# EAGLE design STM32F050_BreakoutBoard (EAGLE 6.4)
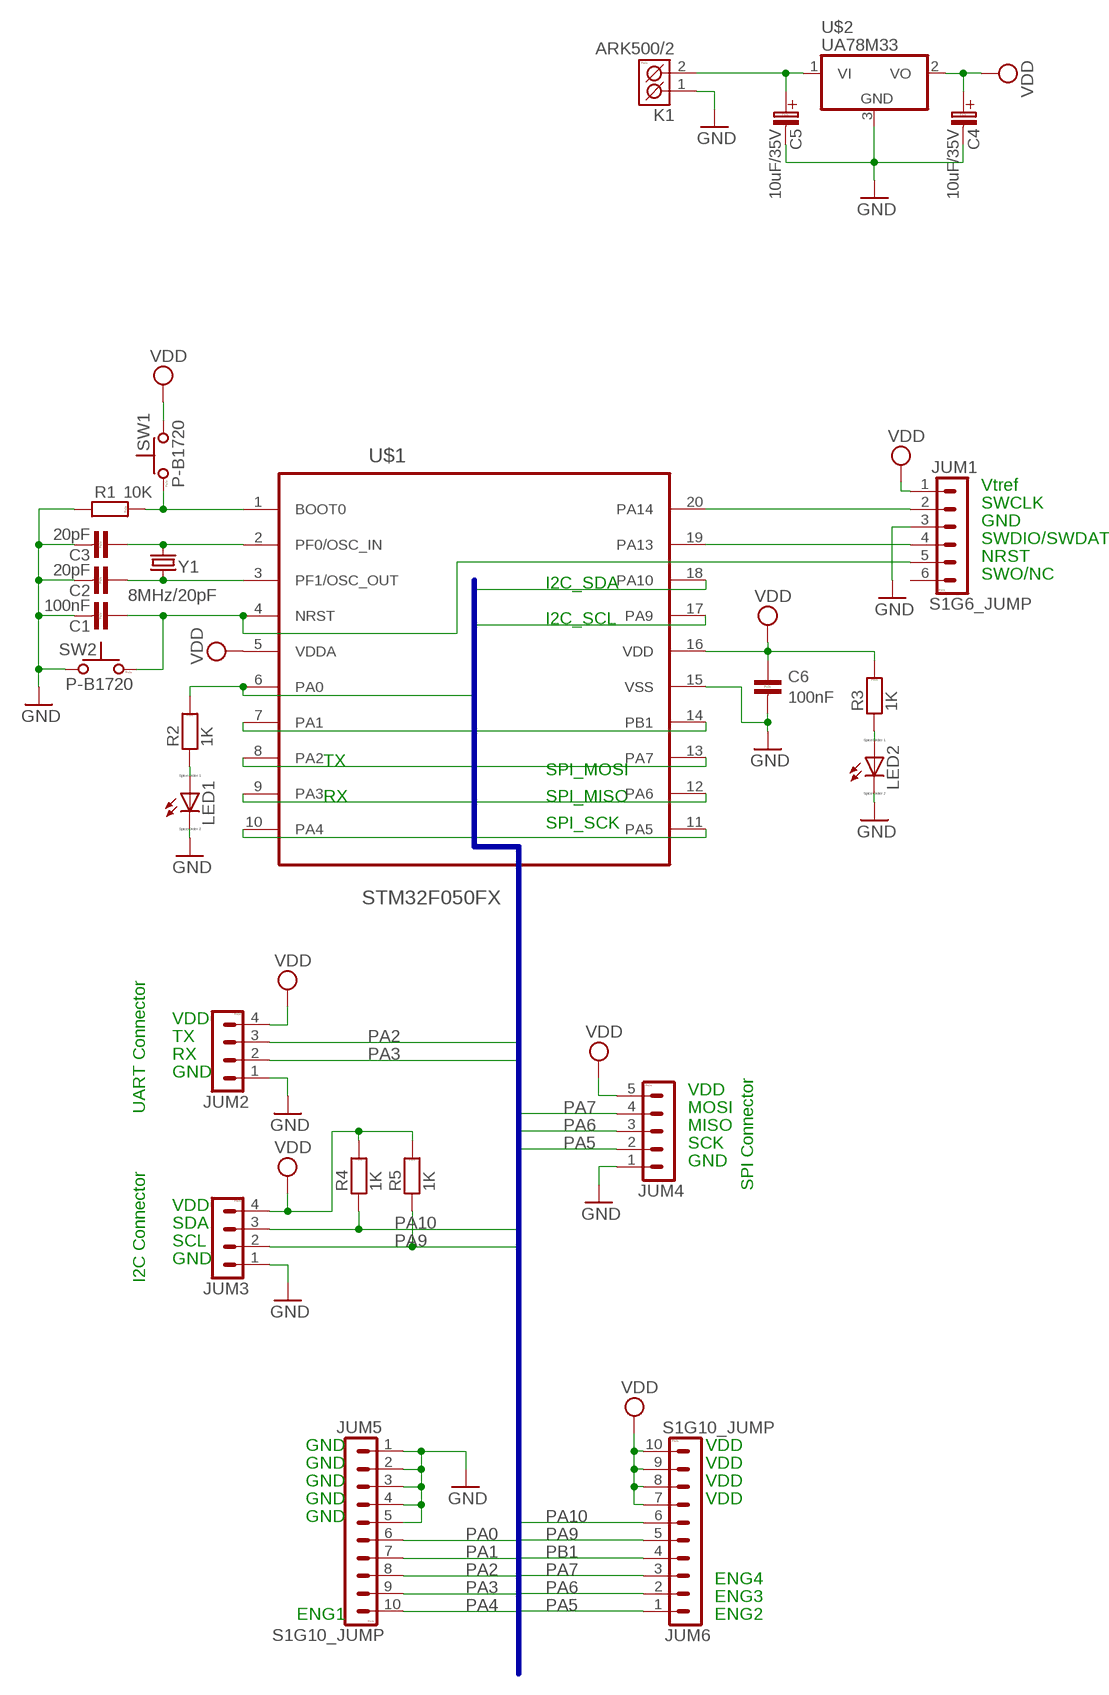
[diagram p0: schematic, sheet 1]

## Parts
C1  100nF  C-KERAMIK_SMD_1206  [1206]
C2  20pF  C-KERAMIK_SMD_1206  [1206]
C3  20pF  C-KERAMIK_SMD_1206  [1206]
C4  10uF/35V  C-ELEKTROLYT_2,5  [C-EL_2,5]
C5  10uF/35V  C-ELEKTROLYT_2,5  [C-EL_2,5]
C6  100nF  C-KERAMIK_SMD_1206  [1206]
JUM1  S1G6_JUMP  [S1G6_JUM]
JUM2  S1G4_JUMP  [S1G4_JUM]
JUM3  S1G4_JUMP  [S1G4_JUM]
JUM4  S1G5_JUMP  [S1G5_JUM]
JUM5  S1G10_JUMP  [S1G10_JU]
JUM6  S1G10_JUMP  [S1G10_JU]
K1  ARK500/2  [ARK500/2]
LED1  LED_E  [LED_1206]
LED2  LED_E  [LED_1206]
R1  10K  R_SMD_1206  [1206]
R2  1K  R_SMD_1206  [1206]
R3  1K  R_SMD_1206  [1206]
R4  1K  R_SMD_1206  [1206]
R5  1K  R_SMD_1206  [1206]
SW1  P-B1720  [P-B1720]
SW2  P-B1720  [P-B1720]
U$1  STM32F050FX  [TSSOP20]
U$2  UA78M33  [TO252]
Y1  8MHz/20pF  CRYSTALSMD  [HC49UP]

## Nets
GND: C1.2 C2.2 C3.2 C4.C-(C_EL-) C5.C-(C_EL-) C6.2 JUM1.3 JUM2.1 JUM3.1 JUM4.1 JUM5.1 JUM5.2 JUM5.3 JUM5.4 JUM5.5 K1.1(K1) LED1.C LED2.C R1.1 SW2.2 U$1.15(VSS) U$2.3(GND)
N$1: C3.1 U$1.2(PF0/OSC_IN) Y1.2
N$2: C2.1 U$1.3(PF1/OSC_OUT) Y1.1
N$3: R1.2 SW1.1 U$1.1(BOOT0)
N$4: C5.C+(C_EL+) K1.2(K2) U$2.1(VI)
N$7: LED1.A R2.1
N$8: JUM1.2 U$1.20(PA14)
N$9: JUM1.4 U$1.19(PA13)
N$10: C1.1 JUM1.5 SW2.1 U$1.4(NRST)
N$11: LED2.A R3.1
PA0: JUM5.6 R2.2 U$1.6(PA0)
PA1: JUM5.7 U$1.7(PA1)
PA2: JUM2.3 JUM5.8 U$1.8(PA2)
PA3: JUM2.2 JUM5.9 U$1.9(PA3)
PA4: JUM5.10 U$1.10(PA4)
PA5: JUM4.2 JUM6.1 U$1.11(PA5)
PA6: JUM4.3 JUM6.2 U$1.12(PA6)
PA7: JUM4.4 JUM6.3 U$1.13(PA7)
PA9: JUM3.2 JUM6.5 R5.1 U$1.17(PA9)
PA10: JUM3.3 JUM6.6 R4.1 U$1.18(PA10)
PB1: JUM6.4 U$1.14(PB1)
VDD: C4.C+(C_EL+) C6.1 JUM1.1 JUM2.4 JUM3.4 JUM4.5 JUM6.7 JUM6.8 JUM6.9 JUM6.10 R3.2 R4.2 R5.2 SW1.2 U$1.5(VDDA) U$1.16(VDD) U$2.2(VO)
Unconnected: JUM1.6 SW1.3 SW1.4 SW2.3 SW2.4

## Buses
PA[0..7],PA9,PA10,PB1

## Notes on the sheet
- Vtref
- SWCLK
- GND
- SWDIO/SWDAT
- NRST
- SWO/NC
- I2C_SDA
- I2C_SCL
- TX
- SPI_MOSI
- RX | SPI_MISO
- SPI_SCK
- VDD
- TX
- RX
- GND | SPI Connector
- VDD
- UART Connector | MOSI
- MISO
- SCK
- GND
- VDD
- SDA
- SCL
- GND
- I2C Connector
- GND | VDD
- GND | VDD
- GND | VDD
- GND | VDD
- GND
- ENG4
- ENG3
- ENG1 | ENG2

## Library data of the parts
C1-C3 C6 = #PaJa_30:C-KERAMIK: Kondenzator - keramicky
C4 C5 = #PaJa_30:C-ELEKTROLYT: Kondenzator - elektrolyticky
JUM1 = #PaJa_konektory:S1G6_JUMP: Radove konektory - koliky - 6x
JUM2 JUM3 = #PaJa_konektory:S1G4_JUMP: Radove konektory - koliky - 4x
JUM4 = #PaJa_konektory:S1G5_JUMP: Radove konektory - koliky - 5x
JUM5 JUM6 = #PaJa_konektory:S1G10_JUMP: Radove konektory - koliky - 10x
K1 = #PaJa_konektory:ARK500/2: Svorkovnice - roztec 5mm - dvojita
LED1 LED2 = eagle-ltspice:LED_E: LED Source: http://www.osram.convergy.de Source: www.luxeon.com Source: www.kingbright.com; SPICEMODEL: NONE; SPICEPREFIX: D; SPICETYPE: diode
R1-R5 = #PaJa_30:R: Rezistor
SW1 SW2 = #PaJa_prepinace:P-B1720: µ-tlacitko
U$1 = !moje_Sobriety:STM32F050FX
U$2 = !moje_Sobriety:UA78M33
Y1 = SparkFun:CRYSTAL: Crystals Various standard crystals. Proven footprints. Spark Fun Electronics SKU : COM-00534

## Board
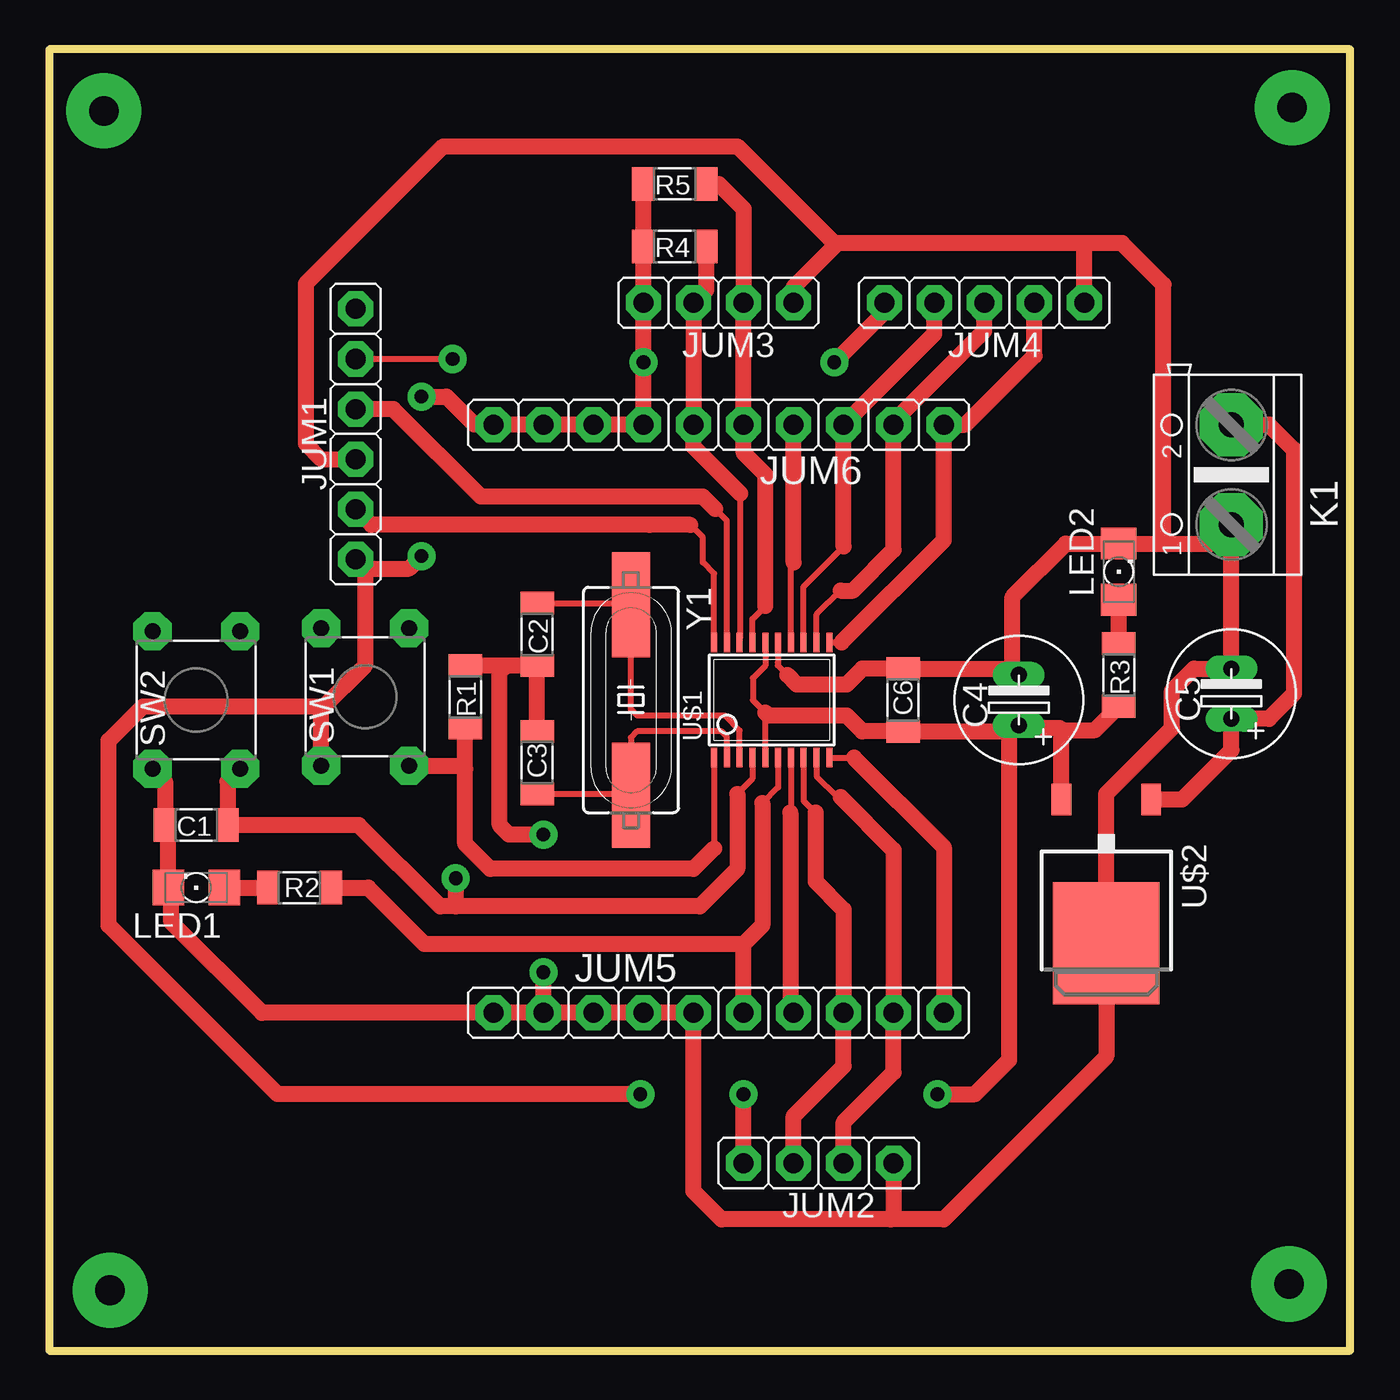
[diagram p1: board, top side]
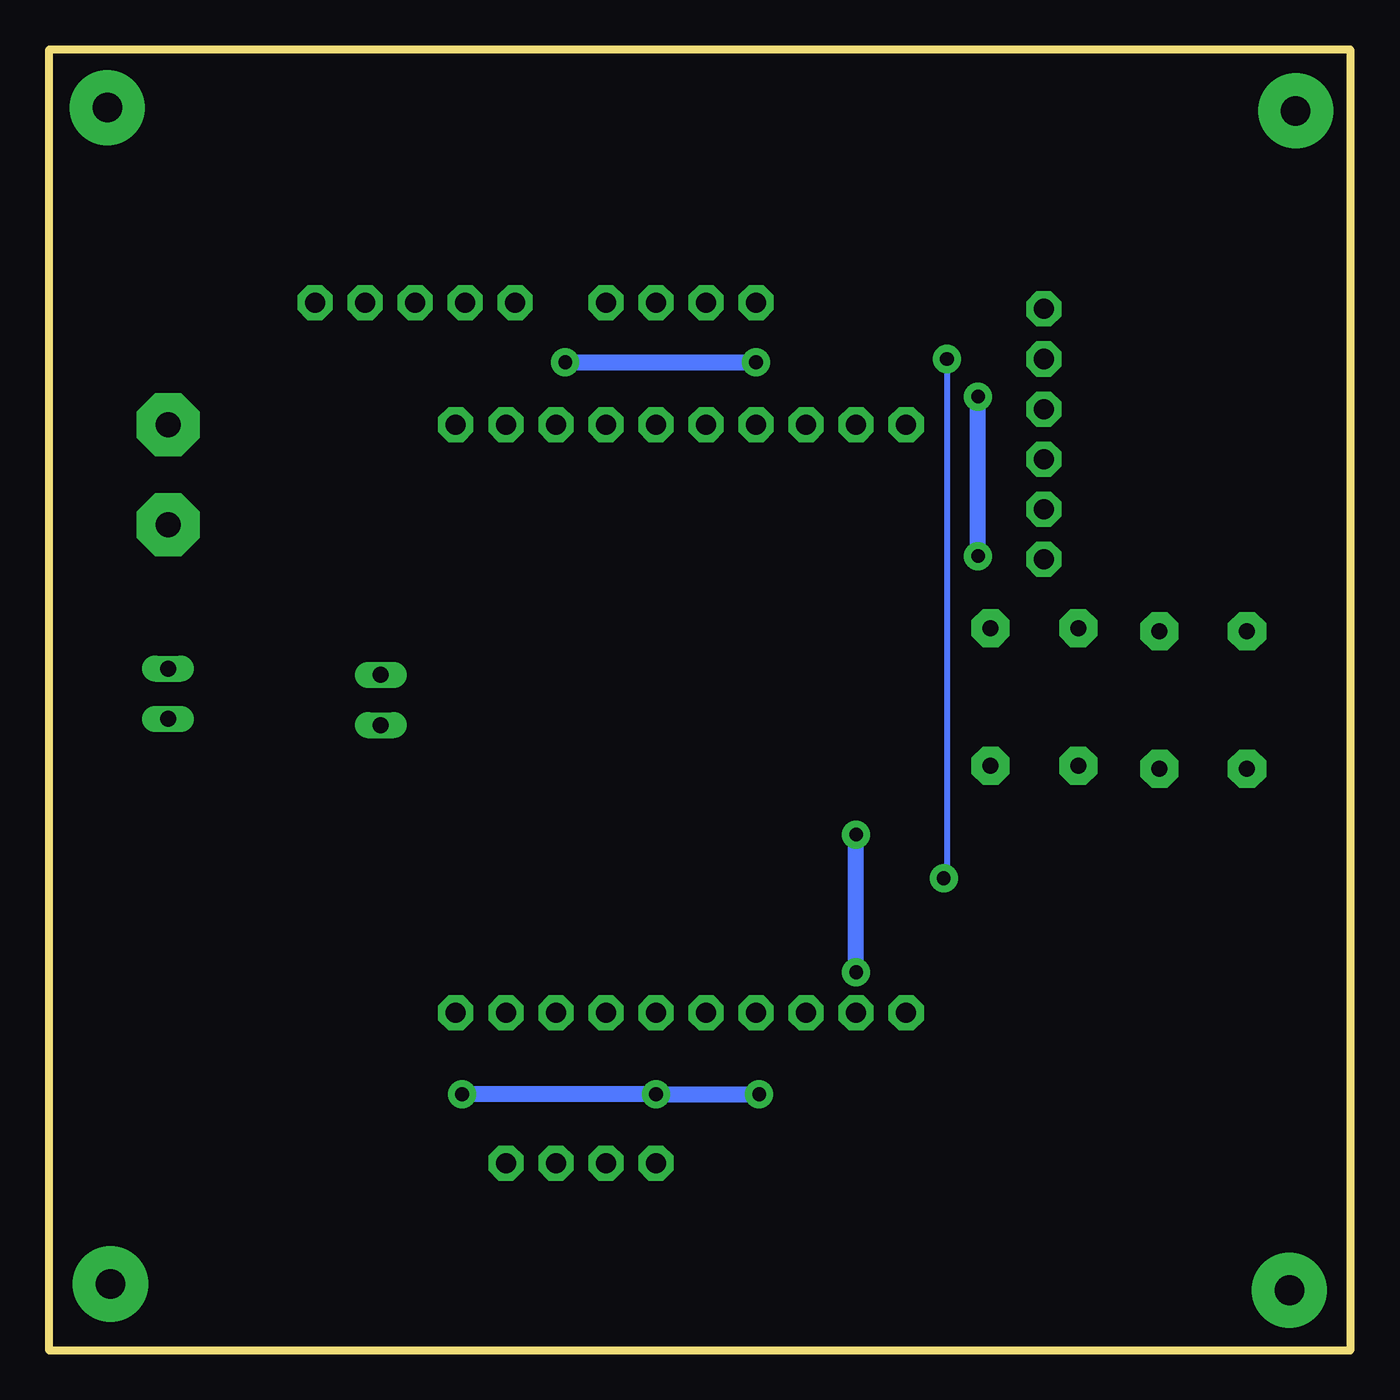
[diagram p2: board, bottom side, seen from below]

Size 66.04 x 66.04 mm. Coordinates in mm from the lower left corner, seen from the top.
Outline: 0,0 66.04,0 66.04,66.04 0,66.04 0,0
Copper layers (1*16): Top 0.035mm / dielectric 1.5mm / Bottom 0.035mm
Design rules "default": minimum track width 10mil, minimum drill 24mil, track to track 8mil, track to pad 8mil, pad to pad 8mil, via to via 8mil, smd to smd 8mil, copper to edge 40mil, drill to drill 8mil, minimum pad ring 10mil, minimum via ring 8mil, stop-mask expansion 4mil, vias tented up to drill 0mil, thermal gap 10mil

### Footprints (pad centres in the part's own frame; a part is rotated, then mirrored left to right if it is on the bottom)
1206 = smd 1.143 x 1.702: 1 -1.587,0; 2 1.587,0
C-EL_2,5 = drill 0.813 pad 1.27 long: C+ -1.27,0; C- 1.27,0
S1G6_JUM = drill 1.016 pad 1.778 octagon: 1 -6.35,0; 2 -3.81,0; 3 -1.27,0; 4 1.27,0; 5 3.81,0; 6 6.35,0
S1G4_JUM = drill 1.016 pad 1.778 octagon: 1 -3.81,0; 2 -1.27,0; 3 1.27,0; 4 3.81,0
S1G5_JUM = drill 1.016 pad 1.778 octagon: 1 -5.08,0; 2 -2.54,0; 3 0,0; 4 2.54,0; 5 5.08,0
S1G10_JU = drill 1.016 pad 1.778 octagon: 1 -11.43,0; 2 -8.89,0; 3 -6.35,0; 4 -3.81,0; 5 -1.27,0; 6 1.27,0; 7 3.81,0; 8 6.35,0; 9 8.89,0; 10 11.43,0
ARK500/2 = drill 1.27 pad 3.2 octagon: 1 -2.54,0; 2 2.54,0
LED_1206 = smd 1.6 x 1.803: A -1.422,0; C 1.422,0
P-B1720 = drill 0.813 pad 1.93 octagon: 1 -3.493,-2.223; 2 -3.493,2.223; 3 3.493,-2.223; 4 3.493,2.223
TSSOP20 = smd 0.305 x 0.991: 1 -2.925,-2.918; 2 -2.275,-2.918; 3 -1.625,-2.918; 4 -0.975,-2.918; 5 -0.325,-2.918; 6 0.325,-2.918; 7 0.975,-2.918; 8 1.625,-2.918; 9 2.275,-2.918; 10 2.925,-2.918; 11 2.925,2.918; 12 2.275,2.918; 13 1.625,2.918; 14 0.975,2.918; 15 0.325,2.918; 16 -0.325,2.918; 17 -0.975,2.918; 18 -1.625,2.918; 19 -2.275,2.918; 20 -2.925,2.918
TO252 = smd 1 x 1.6: 1 -2.28,-4.8; 2 2.28,-4.8 | smd 5.4 x 6.2: 3 0,2.5
HC49UP = smd 5.334 x 1.93: 1 -4.826,0; 2 4.826,0

### Placement (x,y rotation side)
C1  7.46,26.67 180 top
C2  24.77,36.35 270 top
C3  24.77,29.85 90 top
C4  49.21,33.02 90 top
C5  60.01,33.34 90 top
C6  43.34,33.02 90 top
JUM1  15.56,46.51 90 top
JUM2  39.05,9.53 180 top
JUM3  33.97,53.18 180 top
JUM4  47.47,53.18 180 top
JUM5  33.97,17.14 0 top
JUM6  33.97,46.99 180 top
K1  60.01,44.45 90 top
LED1  7.46,23.5 180 top
LED2  54.29,39.53 90 top
R1  21.11,33.18 270 top
R2  12.7,23.5 0 top
R3  54.29,34.29 270 top
R4  31.75,56.04 180 top
R5  31.75,59.21 180 top
SW1  16.03,33.18 90 top
SW2  7.46,33.02 90 top
U$1  36.67,33.02 0 top
U$2  53.66,23.18 180 top
Y1  29.53,33.02 270 top

### Tracks (layer width: path | path; a pad name or v marks a point on that pad's centre or on a via)
GND  (via drill 0.7 pad 1.42)
  Top 0.305: U$1.15 37,34.93 36.99,34.92 36.99,34.77 37.46,34.29
  Top 0.813: SW2.2 5.87,28.89 C1.2 6.04,26.5 LED1.C 6.19,23.34 6.19,21.75 10.79,17.14 JUM5.1 JUM5.2 | 48.89,34.61 C6.2 41.27,34.61 40.48,33.81 37.94,33.81 37.46,34.29 | 48.89,34.61 C4.C- | 48.89,34.61 48.89,38.26 51.59,40.96 LED2.C 56.55,40.95 | 56.55,40.95 59.05,40.95 K1.1 C5.C- 58.1,34.61 56.99,33.5 56.99,31.59 53.66,28.26 U$2.3 53.66,14.92 45.4,6.67 42.7,6.67 | 56.55,40.95 56.55,54.1 54.45,56.2 52.7,56.2 | JUM4.1 52.55,56.04 52.7,56.2 | JUM1.3 13.81,45.24 13.02,46.04 13.02,54.13 20,61.12 34.92,61.12 39.85,56.2 40,56.2 | 42.7,6.67 34.13,6.67 32.7,8.1 JUM5.5 JUM5.4 JUM5.3 JUM5.2 | JUM2.1 42.86,6.83 42.7,6.67 | C3.2 C2.2 23.18,34.77 | 23.18,34.77 R1.1 | JUM5.2 v25.08,19.21 | v25.08,26.19 23.34,26.19 22.86,26.67 22.86,34.45 23.18,34.77 | 52.7,56.2 40,56.2 | JUM3.1 37.78,53.97 40,56.2
  Bottom 0.813: v25.08,19.21 v25.08,26.19
N$1
  Top 0.305: U$1.2 34.4,31.17 34.13,31.43 29.84,31.43 29.53,31.11 Y1.2 29.46,28.26 C3.1
N$2
  Top 0.305: U$1.3 35.05,31.47 34.29,32.23 29.84,32.23 29.53,32.54 Y1.1 29.43,37.94 C2.1
N$3
  Top 0.305: U$1.1 33.75,25.49 | 20.95,29.69 21.11,29.53
  Top 0.813: 33.75,25.49 32.7,24.45 22.38,24.45 21.11,25.72 21.11,29.53 R1.2 | SW1.1 20.95,29.69
N$4
  Top 0.813: U$2.1 57.5,27.98 60.01,30.48 C5.C+ 61.91,32.07 63.18,33.34 63.18,45.72 61.91,46.99 K1.2
N$7
  Top 0.813: LED1.A R2.1
N$8
  Top 0.305: U$1.20 33.75,39.44 33.18,40 33.18,41.27 32.54,41.91
  Top 0.813: JUM1.2 16.35,41.91 30.48,41.91 32.54,41.91
N$9
  Top 0.305: U$1.19 34.4,42.12 33.81,42.7
  Top 0.813: JUM1.4 17.46,47.78 21.91,43.34 33.18,43.34 33.81,42.7
N$10  (via drill 0.7 pad 1.42)
  Top 0.305: JUM1.5 v20.48,50.32 | U$1.4 35.7,29.03 34.92,28.26
  Top 0.813: SW2.1 9.05,28.89 C1.1 15.72,26.67 19.84,22.54 20.64,22.54 | 20.64,22.54 33.02,22.54 34.92,24.45 34.92,28.26 | v20.64,23.97 20.64,22.54
  Bottom 0.305: v20.48,50.32 20.48,24.13 v20.64,23.97
N$11
  Top 0.813: R3.1 LED2.A
N$14  (via drill 1.5 pad 3.81)
  other vias: 2.77,62.92
N$15  (via drill 1.5 pad 3.81)
  other vias: 3.09,3.07
N$16  (via drill 1.5 pad 3.81)
  other vias: 62.93,3.38
PA0
  Top 0.305: U$1.6 37,28.58 36.19,27.78
  Top 0.813: R2.2 16.19,23.49 19.05,20.64 35.24,20.64 | JUM5.6 35.24,20.64 | 36.19,27.78 36.19,21.59 35.24,20.64
PA1
  Top 0.305: U$1.7 37.65,27.33 37.62,27.3 | 37.62,17.3 JUM5.7
  Top 0.813: 37.62,27.3 37.62,17.3
PA2
  Top 0.305: U$1.8 38.3,27.9 38.89,27.3
  Top 0.813: 38.89,27.3 38.89,23.81 40.32,22.38 JUM5.8 40.32,14.45 37.78,11.91 JUM2.3
PA3
  Top 0.305: U$1.9 38.95,29.16 40,28.1 40.16,28.1
  Top 0.813: 40.16,28.1 42.86,25.4 JUM5.9 42.86,14.13 40.32,11.59 JUM2.2
PA4
  Top 0.305: U$1.10 40.86,30.1
  Top 0.813: 40.86,30.1 45.4,25.56 JUM5.10
PA5
  Top 0.305: U$1.11 40.22,35.94
  Top 0.813: JUM4.2 50.01,50.48 46.51,46.99 JUM6.1 45.4,41.12 40.22,35.94
PA6
  Top 0.305: U$1.12 38.95,37.36 40.16,38.58
  Top 0.406: JUM6.2 42.86,47.15
  Top 0.813: 42.86,47.15 47.47,51.75 JUM4.3 | 40.16,38.58 40.8,38.58 42.86,40.64 JUM6.2
PA7
  Top 0.305: U$1.13 38.3,38.77 40.32,40.8
  Top 0.813: JUM4.4 44.93,51.59 JUM6.3 40.32,40.8
PA9
  Top 0.305: 35.08,53.34 JUM3.2 | U$1.17 35.7,37.12 36.35,37.78
  Top 0.813: R5.1 33.97,59.21 35.24,57.94 JUM3.2 JUM6.5 35.24,45.56 36.35,44.45 36.35,37.78
PA10
  Top 0.305: U$1.18 35.05,36.16 35.08,36.19 35.08,43.5
  Top 0.813: R4.1 33.34,53.82 JUM3.3 JUM6.6 32.7,45.88 35.08,43.5
PB1
  Top 0.305: U$1.14 37.65,39.87 37.78,40
  Top 0.813: 37.78,40 JUM6.4
S$82  (via drill 1.5 pad 3.81)
  other vias: 63.09,63.07
VDD  (via drill 0.7 pad 1.42)
  Top 0.305: U$1.5 36.35,32.38 35.72,33.01 35.72,34.13 36.35,34.76 U$1.16
  Top 0.813: C4.C+ 48.89,31.43 C6.1 41.27,31.43 40.48,32.23 36.5,32.23 36.35,32.38 | C4.C+ 49.37,31.59 51.28,31.59 51.38,31.49 | U$2.2 51.38,31.49 | 51.38,31.49 53.08,31.49 R3.2 | JUM4.5 42.39,52.7 v39.85,50.16 | JUM2.4 v35.24,13.02 | v45.08,13.02 46.99,13.02 48.74,14.76 48.74,31.27 C4.C+ | SW1.2 13.81,32.54 | v30,13.02 11.59,13.02 3.02,21.59 3.02,30.96 4.76,32.7 13.65,32.7 13.81,32.54 | 16.03,39.69 16.03,34.77 13.81,32.54 | v18.89,48.42 20.16,48.42 21.59,46.99 JUM6.10 JUM6.9 JUM6.8 JUM6.7 v30.16,50.16 JUM3.4 R4.2 R5.2 | 18.73,40.16 v18.89,40.32 18.26,39.69 16.03,39.69 | 16.03,39.69 JUM1.1
  Bottom 0.813: v39.85,50.16 v30.16,50.16 | v45.08,13.02 v35.24,13.02 v30,13.02 | v18.89,40.32 v18.89,48.42